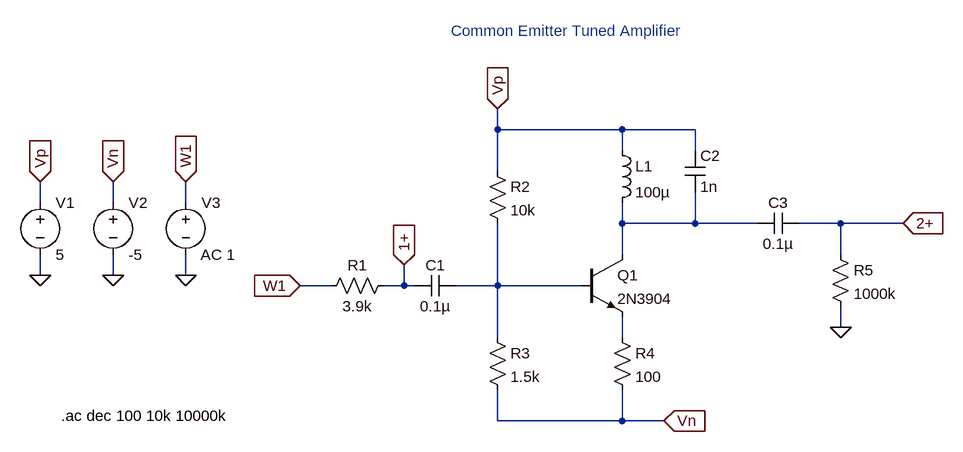
[diagram p0: schematic ce_tuned_amp_ltspice.asc]
ce_tuned_amp_ltspice.asc, the LTspice schematic file:
Version 4
SHEET 1 960 680
WIRE 240 -64 240 -96
WIRE 432 -64 240 -64
WIRE 544 -64 432 -64
WIRE 432 -32 432 -64
WIRE 544 -32 544 -64
WIRE 240 0 240 -64
WIRE -464 48 -464 16
WIRE -352 48 -352 16
WIRE -240 48 -240 16
WIRE 432 80 432 48
WIRE 544 80 544 32
WIRE 544 80 432 80
WIRE 640 80 544 80
WIRE 768 80 704 80
WIRE 864 80 768 80
WIRE 432 128 432 80
WIRE 768 128 768 80
WIRE -464 160 -464 128
WIRE -352 160 -352 128
WIRE -240 160 -240 128
WIRE -16 176 -64 176
WIRE 96 176 96 144
WIRE 96 176 64 176
WIRE 112 176 96 176
WIRE 240 176 240 80
WIRE 240 176 176 176
WIRE 368 176 240 176
WIRE 768 240 768 208
WIRE 240 256 240 176
WIRE 432 256 432 224
WIRE 240 384 240 336
WIRE 432 384 432 336
WIRE 432 384 240 384
WIRE 496 384 432 384
FLAG 768 240 0
FLAG -64 176 W1
IOPIN -64 176 In
FLAG 864 80 2+
IOPIN 864 80 In
FLAG 496 384 Vn
IOPIN 496 384 In
FLAG 240 -96 Vp
IOPIN 240 -96 In
FLAG 96 144 1+
IOPIN 96 144 In
FLAG -464 160 0
FLAG -352 160 0
FLAG -240 160 0
FLAG -464 16 Vp
IOPIN -464 16 In
FLAG -352 16 Vn
IOPIN -352 16 In
FLAG -240 16 W1
IOPIN -240 16 In
SYMBOL res 80 160 R90
WINDOW 0 0 56 VBottom 2
WINDOW 3 32 56 VTop 2
SYMATTR InstName R1
SYMATTR Value 3.9k
SYMBOL cap 176 160 R90
WINDOW 0 0 32 VBottom 2
WINDOW 3 32 32 VTop 2
SYMATTR InstName C1
SYMATTR Value 0.1µ
SYMBOL res 224 -16 R0
SYMATTR InstName R2
SYMATTR Value 10k
SYMBOL res 224 240 R0
SYMATTR InstName R3
SYMATTR Value 1.5k
SYMBOL res 416 240 R0
SYMATTR InstName R4
SYMATTR Value 100
SYMBOL npn 368 128 R0
SYMATTR InstName Q1
SYMATTR Value 2N3904
SYMBOL ind 416 -48 R0
SYMATTR InstName L1
SYMATTR Value 100µ
SYMBOL cap 528 -32 R0
SYMATTR InstName C2
SYMATTR Value 1n
SYMBOL cap 704 64 R90
WINDOW 0 0 32 VBottom 2
WINDOW 3 32 32 VTop 2
SYMATTR InstName C3
SYMATTR Value 0.1µ
SYMBOL res 752 112 R0
SYMATTR InstName R5
SYMATTR Value 1000k
SYMBOL voltage -464 32 R0
WINDOW 123 0 0 Left 0
WINDOW 39 0 0 Left 0
SYMATTR InstName V1
SYMATTR Value 5
SYMBOL voltage -352 32 R0
WINDOW 123 0 0 Left 0
WINDOW 39 0 0 Left 0
SYMATTR InstName V2
SYMATTR Value -5
SYMBOL voltage -240 32 R0
WINDOW 123 23 96 Left 2
WINDOW 39 0 0 Left 0
SYMATTR Value2 AC 1
SYMATTR InstName V3
SYMATTR Value ""
TEXT -432 376 Left 2 !.ac dec 100 10k 10000k
TEXT 168 -216 Left 2 ;Common Emitter Tuned Amplifier

The netlist it stands for:
* ce_tuned_amp_ltspice.asc
R1 1+ W1 3.9k
C1 N002 1+ 0.1µ
R2 Vp N002 10k
R3 N002 Vn 1.5k
R4 N003 Vn 100
Q1 N001 N002 N003 0 2N3904
L1 Vp N001 100µ
C2 Vp N001 1n
C3 2+ N001 0.1µ
R5 2+ 0 1000k
V1 Vp 0 5
V2 Vn 0 -5
V3 W1 0 AC 1
.model NPN NPN
.model PNP PNP
.lib standard.bjt
.ac dec 100 10k 10000k
* Common Emitter Tuned Amplifier
.backanno
.end